# Altium project Control_Quadri.PrjPCB
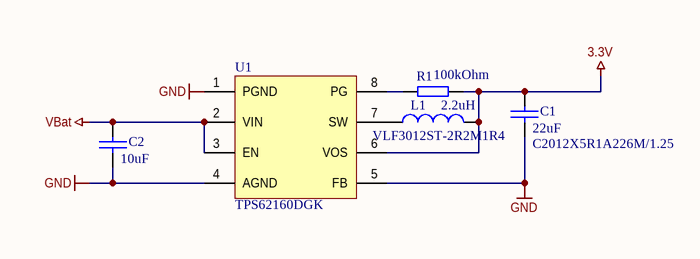
[diagram p0: Alimentation.SchDoc]
4 sheets, 47 parts. Net scope: flat (ports and power ports of the same name join across sheets).
Board file: PCB1.PcbDoc
Sheets:
  Alimentation.SchDoc
  ControlCommande&Motors.SchDoc
  Capteurs.SchDoc
  InterfaceExtension.SchDoc

## Sheet Alimentation.SchDoc
size A3; Organization: Altium Limited; Address1: Laboratoire de Systèmes Embarqués; Address2: 7, rue de la Serre; Address3: 2610 Saint-Imier / Switzerland; PageSetup: Record=PageOptions|CenterHorizontal=True|CenterVertical=True|PrintScale=0.24|XCorrection=1.00|YCorrection=1.00|PrintKind=0|BorderSize=5000000|LeftOffset=0|BottomOffset=0|Orientation=2|PaperLength=1000|PaperWidth=1000|Scale=100|PaperSource=7|PrintQuality=-4|MediaType=1|DitherType=10|PaperKind=A4|PrintScaleMode=1

### Parts
C1  C2012X5R1A226M/1.25  value 22uF  [080501]
C2  value 10uF  [080501]  (hidden comment: GRM21BR61E106KA73L)
L1  VLF3012ST-2R2M1R4  value 2.2uH  [080503]
R1  value 100kOhm  [080501]  (hidden comment: ERJ-6GEYJ104V)
U1  TPS62160DGK  [TSOP65P490-8AM]

### Nets
3.3V: C1.1 L1.2 R1.2 U1.6(VOS)
GND: C1.2 C2.2 U1.1(PGND) U1.4(AGND) U1.5(FB)
VBat: C2.1 U1.2(VIN) U1.3(EN)
NetL1_1: L1.1 U1.7(SW)
NetR1_1: R1.1 U1.8(PG)

### Notes on the sheet
- Title
- Size:
- Date:
- A3
- Author:
- Time:
- Revision:
- Sheet
- of
- File:

### Library data of the parts
C1 C2 = CAPA: EtatCommande: Interne; Text Field1: CAPA; Supplier 1: Digi-Key
  C1: Supplier Part Number 1: 445-7665-1-ND
  C2: Supplier Part Number 1: 490-5523-1-ND
L1 = INDUCTOR: EtatCommande: Commandé; Text Field1: INDUCTOR; Supplier 1: Digi-Key; Supplier Part Number 1: 445-4200-1-ND
R1 = RES: Text Field1: RESISTANCE; EtatCommande: Interne; Supplier 1: Digi-Key; Supplier Part Number 1: P100KACT-ND
U1 = TPS62160: IC BUCK SYNC ADJ 1A 8MSOP; EtatCommande: Commandé; Part Name: TPS62160DGK; Supplier 1: Digi-Key; Supplier Part Number 1: 296-30318-1-ND

## Sheet ControlCommande&Motors.SchDoc
size A3; Organization: Altium Limited; Address1: Laboratoire de Systèmes Embarqués; Address2: 7, rue de la Serre; Address3: 2610 Saint-Imier / Switzerland; PageSetup: Record=PageOptions|CenterHorizontal=True|CenterVertical=True|PrintScale=0.24|XCorrection=1.00|YCorrection=1.00|PrintKind=0|BorderSize=5000000|LeftOffset=0|BottomOffset=0|Orientation=2|PaperLength=1000|PaperWidth=1000|Scale=100|PaperSource=7|PrintQuality=-4|MediaType=1|DitherType=10|PaperKind=A4|PrintScaleMode=1
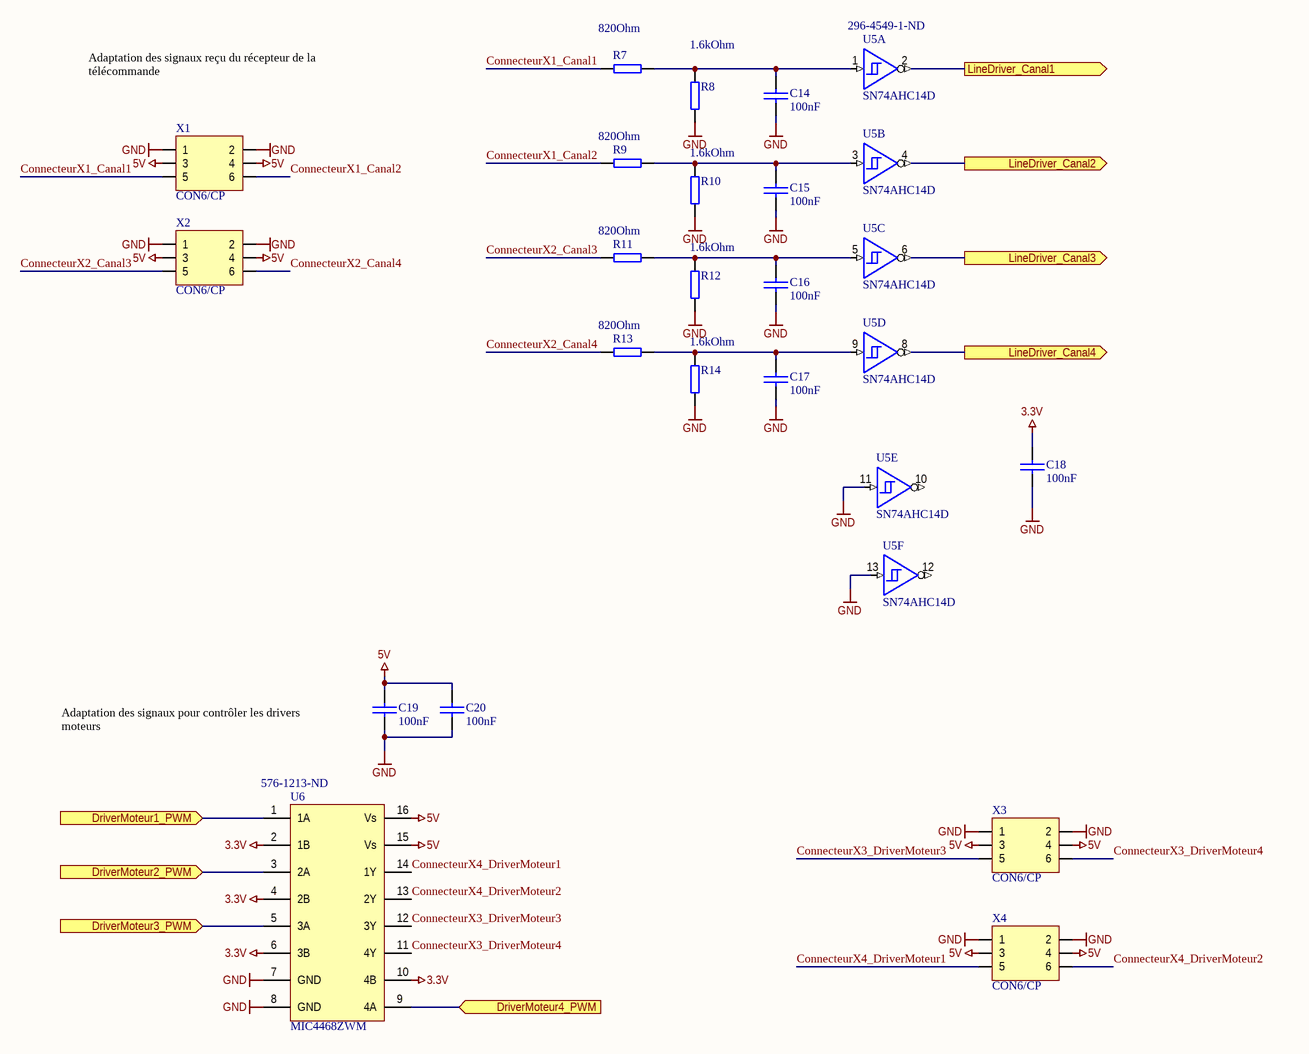
[diagram p1: ControlCommande&Motors.SchDoc]

### Parts
C14  value 100nF  [060301]  (hidden comment: GRM188R71E104KA01D)
C15  value 100nF  [060301]  (hidden comment: GRM188R71E104KA01D)
C16  value 100nF  [060301]  (hidden comment: GRM188R71E104KA01D)
C17  value 100nF  [060301]  (hidden comment: GRM188R71E104KA01D)
C18  value 100nF  [060301]  (hidden comment: GRM188R71E104KA01D)
C19  value 100nF  [060301]  (hidden comment: GRM188R71E104KA01D)
C20  value 100nF  [060301]  (hidden comment: GRM188R71E104KA01D)
R7  value 820Ohm  [080501]  (hidden comment: RMCF0805JT820R)
R8  value 1.6kOhm  [080501]  (hidden comment: ERJ-6GEYJ162V)
R9  value 820Ohm  [080501]  (hidden comment: RMCF0805JT820R)
R10  value 1.6kOhm  [080501]  (hidden comment: ERJ-6GEYJ162V)
R11  value 820Ohm  [080501]  (hidden comment: RMCF0805JT820R)
R12  value 1.6kOhm  [080501]  (hidden comment: ERJ-6GEYJ162V)
R13  value 820Ohm  [080501]  (hidden comment: RMCF0805JT820R)
R14  value 1.6kOhm  [080501]  (hidden comment: ERJ-6GEYJ162V)
U5  SN74AHC14D  Supplier Part Number 1: 296-4549-1-ND  [SO1401]  (parts A,B,C,D,E,F of 6)
U6  MIC4468ZWM  Supplier Part Number 1: 576-1213-ND  [SOIC127P1030-16M]
X1  CON6/CP  [J2X3_2.54]
X2  CON6/CP  [J2X3_2.54]
X3  CON6/CP  [J2X3_2.54]
X4  CON6/CP  [J2X3_2.54]

### Ports
DriverMoteur1_PWM (in), DriverMoteur2_PWM (in), DriverMoteur3_PWM (in), DriverMoteur4_PWM (in), LineDriver_Canal1 (out), LineDriver_Canal2 (out), LineDriver_Canal3 (out), LineDriver_Canal4 (out)

### Nets
3.3V: C18.1 U5.14(3.3V) U6.2(1B) U6.4(2B) U6.6(3B) U6.10(4B)
5V: C19.1 C20.1 U6.15(Vs) U6.16(Vs) X1.3 X1.4 X2.3 X2.4 X3.3 X3.4 X4.3 X4.4
GND: C14.2 C15.2 C16.2 C17.2 C18.2 C19.2 C20.2 R8.2 R10.2 R12.2 R14.2 U5.7(GND) U5.11 U5.13 U6.7(GND) U6.8(GND) X1.1 X1.2 X2.1 X2.2 X3.1 X3.2 X4.1 X4.2
ConnecteurX1_Canal1: R7.1 X1.5
ConnecteurX1_Canal2: R9.1 X1.6
ConnecteurX2_Canal3: R11.1 X2.5
ConnecteurX2_Canal4: R13.1 X2.6
ConnecteurX3_DriverMoteur3: U6.12(3Y) X3.5
ConnecteurX3_DriverMoteur4: U6.11(4Y) X3.6
ConnecteurX4_DriverMoteur1: U6.14(1Y) X4.5
ConnecteurX4_DriverMoteur2: U6.13(2Y) X4.6
NetC14_1: C14.1 R7.2 R8.1 U5.1
NetC15_1: C15.1 R9.2 R10.1 U5.3
NetC16_1: C16.1 R11.2 R12.1 U5.5
NetC17_1: C17.1 R13.2 R14.1 U5.9
NetU5_2: U5.2 ; port LineDriver_Canal1
NetU5_4: U5.4 ; port LineDriver_Canal2
NetU5_6: U5.6 ; port LineDriver_Canal3
NetU5_8: U5.8 ; port LineDriver_Canal4
NetU6_1: U6.1(1A) ; port DriverMoteur1_PWM
NetU6_3: U6.3(2A) ; port DriverMoteur2_PWM
NetU6_5: U6.5(3A) ; port DriverMoteur3_PWM
NetU6_9: U6.9(4A) ; port DriverMoteur4_PWM

Not connected (* = marked no-connect by the designer): U5 10 12

### Notes on the sheet
- (near X1) Adaptation des signaux reçu du récepteur de la télécommande
- Adaptation des signaux pour contrôler les drivers moteurs
- Title
- Size:
- Date:
- A3
- Author:
- Time:
- Revision:
- Sheet
- of
- File:

### Library data of the parts
C14-C20 = CAPA: EtatCommande: Interne; Text Field1: CAPA; Supplier 1: Digi-Key; Supplier Part Number 1: 490-1524-1-ND
R7-R14 = RES: as R1 on sheet Alimentation; Supplier 1: Digi-Key
  R7 R9 R11 R13: Supplier Part Number 1: RMCF0805JT820RDKR-ND
  R8 R10 R12 R14: Supplier Part Number 1: P1.6KACT-ND
U5 = SN74AHC14D: EtatCommande: Commandé; Supplier 1: Digi-Key
U6 = MIC4468: EtatCommande: Commandé; Supplier 1: Digi-Key
X1 = CON6/CP: Connecteur récepteur télécommande cannaux 1 & 2; EtatCommande: Interne
X2 = CON6/CP: Connecteur récepteur télécommande cannaux 3 & 4; EtatCommande: Interne
X3 = CON6/CP: Connecteur contrôleur moteurs 3 (arrière) & 4 (gauche); EtatCommande: Interne
X4 = CON6/CP: Connecteur contrôleur moteurs 1 (avant) & 2 (droite); EtatCommande: Interne

## Sheet Capteurs.SchDoc
size A3; Organization: Altium Limited; Address1: Laboratoire de Systèmes Embarqués; Address2: 7, rue de la Serre; Address3: 2610 Saint-Imier / Switzerland; PageSetup: Record=PageOptions|CenterHorizontal=True|CenterVertical=True|PrintScale=0.24|XCorrection=1.00|YCorrection=1.00|PrintKind=0|BorderSize=5000000|LeftOffset=0|BottomOffset=0|Orientation=2|PaperLength=1000|PaperWidth=1000|Scale=100|PaperSource=7|PrintQuality=-4|MediaType=1|DitherType=10|PaperKind=A4|PrintScaleMode=1
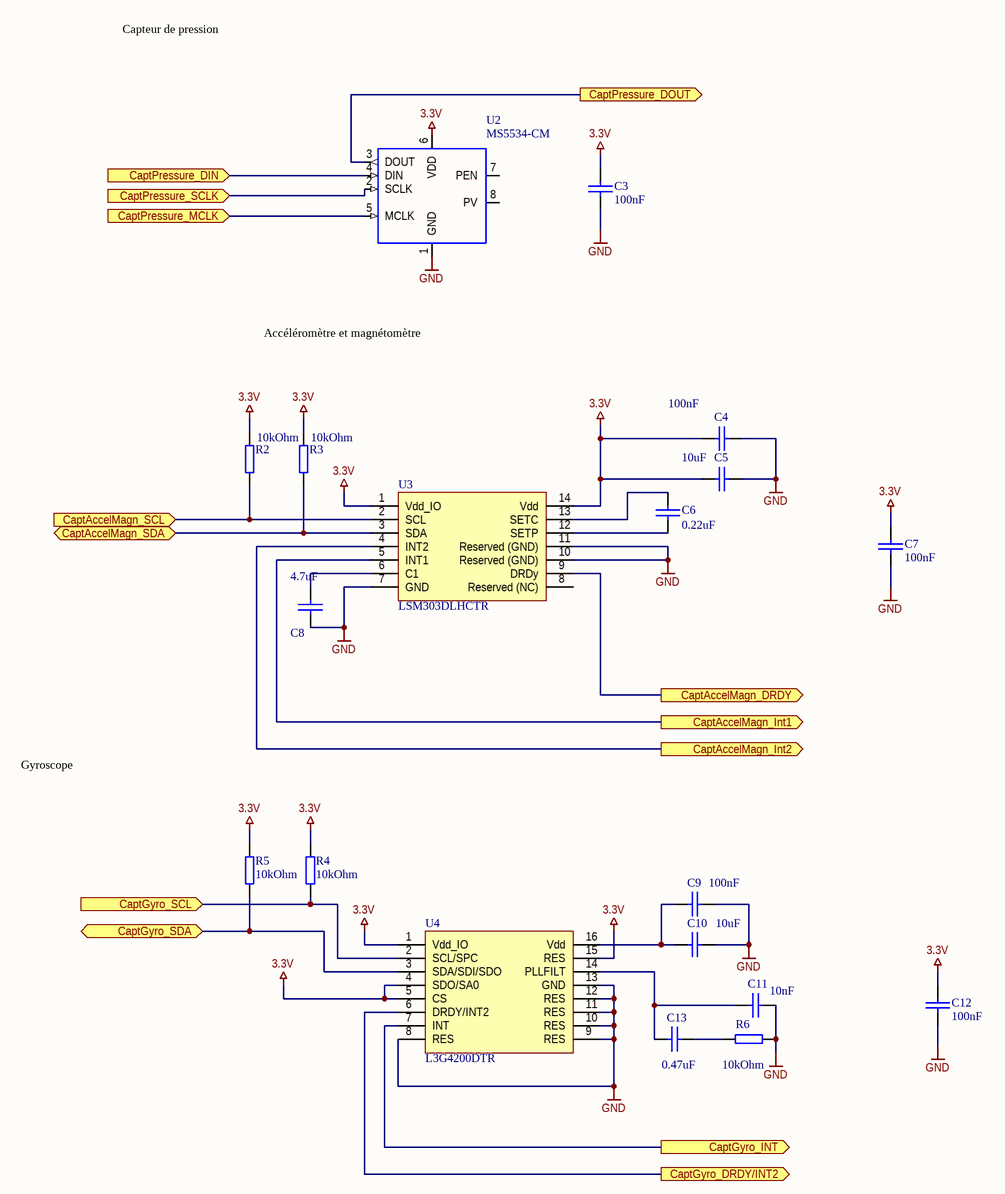
[diagram p2: Capteurs.SchDoc]

### Parts
C3  value 100nF  [060301]  (hidden comment: GRM188R71E104KA01D)
C4  value 100nF  [060301]  (hidden comment: GRM188R71E104KA01D)
C5  value 10uF  [080501]  (hidden comment: 08056D106KAT2A)
C6  value 0.22uF  [120601]  (hidden comment: UMK212F224ZD-T)
C7  value 100nF  [060301]  (hidden comment: GRM188R71E104KA01D)
C8  value 4.7uF  [080501]  (hidden comment: C0805C475K4PACTU)
C9  value 100nF  [060301]  (hidden comment: GRM188R71E104KA01D)
C10  value 10uF  [080501]  (hidden comment: 08056D106KAT2A)
C11  value 10nF  [080501]  (hidden comment: C0805C103K4RACTU)
C12  value 100nF  [060301]  (hidden comment: GRM188R71E104KA01D)
C13  value 0.47uF  [060301]  (hidden comment: C2012Y5V1H474Z/0.85)
R2  value 10kOhm  [080501]  (hidden comment: ERJ-6GEYJ103V)
R3  value 10kOhm  [080501]  (hidden comment: ERJ-6GEYJ103V)
R4  value 10kOhm  [080501]  (hidden comment: ERJ-6GEYJ103V)
R5  value 10kOhm  [080501]  (hidden comment: ERJ-6GEYJ103V)
R6  value 10kOhm  [080501]  (hidden comment: ERJ-6GEYJ103V)
U2  MS5534-CM  [MS5534B]
U3  LSM303DLHCTR  [LGA-14L]
U4  L3G4200DTR  [LGA-16]

### Ports
CaptAccelMagn_DRDY (out), CaptAccelMagn_Int1 (out), CaptAccelMagn_Int2 (out), CaptAccelMagn_SCL (in), CaptAccelMagn_SDA (bidir), CaptGyro_DRDY/INT2 (out), CaptGyro_INT (out), CaptGyro_SCL (in), CaptGyro_SDA (bidir), CaptPressure_DIN (in), CaptPressure_DOUT (out), CaptPressure_MCLK (in), CaptPressure_SCLK (in)

### Nets
3.3V: C3.1 C4.2 C5.2 C7.1 C12.1 R2.2 R3.2 R4.2 R5.2 U2.6(VDD) U3.1(Vdd_IO) U3.14(Vdd) U4.1(Vdd_IO) U4.4(SDO/SA0) U4.5(CS) U4.15(RES)
GND: C3.2 C4.1 C5.1 C7.2 C8.2 C9.1 C10.1 C11.1 C12.2 R6.2 U2.1(GND) U3.7(GND) U3.10(Reserved_(GND)) U3.11(Reserved_(GND)) U4.8(RES) U4.9(RES) U4.10(RES) U4.11(RES) U4.12(RES) U4.13(GND)
NetC6_1: C6.1 U3.12(SETP)
NetC6_2: C6.2 U3.13(SETC)
NetC8_1: C8.1 U3.6(C1)
NetC9_2: C9.2 C10.2 U4.16(Vdd)
NetC11_2: C11.2 C13.2 U4.14(PLLFILT)
NetC13_1: C13.1 R6.1
NetR2_1: R2.1 U3.2(SCL) ; port CaptAccelMagn_SCL
NetR3_1: R3.1 U3.3(SDA) ; port CaptAccelMagn_SDA
NetR4_1: R4.1 U4.2(SCL/SPC) ; port CaptGyro_SCL
NetR5_1: R5.1 U4.3(SDA/SDI/SDO) ; port CaptGyro_SDA
NetU2_2: U2.2(SCLK) ; port CaptPressure_SCLK
NetU2_3: U2.3(DOUT) ; port CaptPressure_DOUT
NetU2_4: U2.4(DIN) ; port CaptPressure_DIN
NetU2_5: U2.5(MCLK) ; port CaptPressure_MCLK
NetU3_4: U3.4(INT2) ; port CaptAccelMagn_Int2
NetU3_5: U3.5(INT1) ; port CaptAccelMagn_Int1
NetU3_9: U3.9(DRDy) ; port CaptAccelMagn_DRDY
NetU4_6: U4.6(DRDY/INT2) ; port CaptGyro_DRDY/INT2
NetU4_7: U4.7(INT) ; port CaptGyro_INT

Not connected (* = marked no-connect by the designer): U2 7(PEN) 8(PV); U3 8(Reserved_(NC))

### Notes on the sheet
- Capteur de pression
- Accéléromètre et magnétomètre
- Gyroscope
- Title
- Size:
- Date:
- A3
- Author:
- Time:
- Revision:
- Sheet
- of
- File:

### Library data of the parts
C3-C5 C7-C13 = CAPA: EtatCommande: Interne; Text Field1: CAPA; Supplier 1: Digi-Key
  C3 C4 C7 C9 C12: Supplier Part Number 1: 490-1524-1-ND
  C5 C10: Supplier Part Number 1: 478-1417-1-ND
  C8: Supplier Part Number 1: C0805C475K4PACTU-ND
  C11: Supplier Part Number 1: C0805C103K4RACTU-ND
  C13: Supplier Part Number 1: 587-1250-1-ND
C6 = CAPA: EtatCommande: Commandé; Text Field1: CAPA; Supplier 1: Digi-Key; Supplier Part Number 1: 587-1306-1-ND
R2-R6 = RES: as R1 on sheet Alimentation; Supplier 1: Digi-Key
  R2 R3 R5 R6: Supplier Part Number 1: P10KACT-ND
  R4: Supplier Part Number 1: P10KADKR-ND
U2 = MS5534B: Barometer Module; EtatCommande: Commandé; Supplier 1: Digi-Key; Supplier Part Number 1: 223-1100-1-ND
U3 = LSM303DLHC: Accéléromètre et magnétomètre; EtatCommande: Commandé; Supplier 1: Digi-Key; Supplier Part Number 1: 497-11918-1-ND
U4 = L3G4200D: Gyroscope; EtatCommande: Commandé; Part Name: L3G4200D; Supplier 1: Digi-Key; Supplier Part Number 1: 497-11071-1-ND

## Sheet InterfaceExtension.SchDoc
size A3; Organization: Altium Limited; Address1: Laboratoire de Systèmes Embarqués; Address2: 7, rue de la Serre; Address3: 2610 Saint-Imier / Switzerland; PageSetup: Record=PageOptions|CenterHorizontal=True|CenterVertical=True|PrintScale=0.24|XCorrection=1.00|YCorrection=1.00|PrintKind=0|BorderSize=5000000|LeftOffset=0|BottomOffset=0|Orientation=2|PaperLength=1000|PaperWidth=1000|Scale=100|PaperSource=7|PrintQuality=-4|MediaType=1|DitherType=10|PaperKind=A4|PrintScaleMode=1
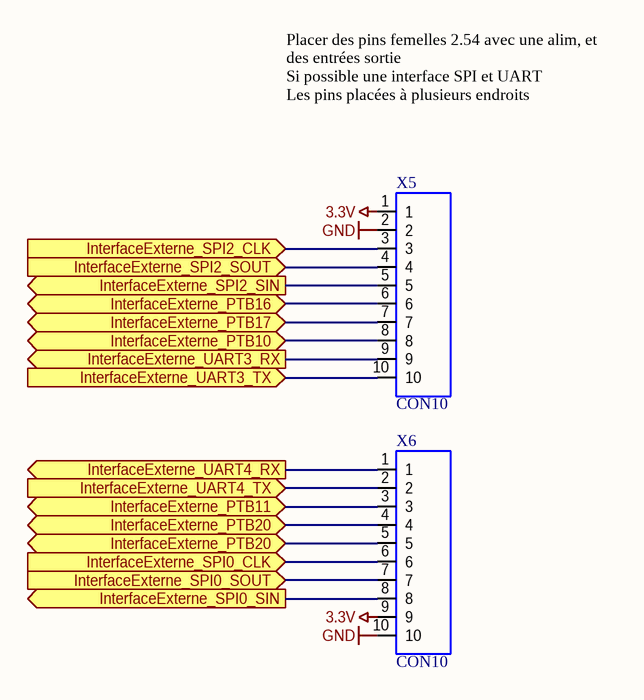
[diagram p3: InterfaceExtension.SchDoc]

### Parts
X5  CON10  [SIP10]
X6  CON10  [SIP10]

### Ports
InterfaceExterne_PTB10 (bidir), InterfaceExterne_PTB11 (bidir), InterfaceExterne_PTB16 (bidir), InterfaceExterne_PTB17 (bidir), InterfaceExterne_PTB20 (bidir), InterfaceExterne_SPI0_CLK (in), InterfaceExterne_SPI0_SIN (out), InterfaceExterne_SPI0_SOUT (in), InterfaceExterne_SPI2_CLK (in), InterfaceExterne_SPI2_SIN (out), InterfaceExterne_SPI2_SOUT (in), InterfaceExterne_UART3_RX (out), InterfaceExterne_UART3_TX (in), InterfaceExterne_UART4_RX (out), InterfaceExterne_UART4_TX (in)

### Nets
3.3V: X5.1 X6.9
GND: X5.2 X6.10
NetX5_3: X5.3 ; port InterfaceExterne_SPI2_CLK
NetX5_4: X5.4 ; port InterfaceExterne_SPI2_SOUT
NetX5_5: X5.5 ; port InterfaceExterne_SPI2_SIN
NetX5_6: X5.6 ; port InterfaceExterne_PTB16
NetX5_7: X5.7 ; port InterfaceExterne_PTB17
NetX5_8: X5.8 ; port InterfaceExterne_PTB10
NetX5_9: X5.9 ; port InterfaceExterne_UART3_RX
NetX5_10: X5.10 ; port InterfaceExterne_UART3_TX
NetX6_1: X6.1 ; port InterfaceExterne_UART4_RX
NetX6_2: X6.2 ; port InterfaceExterne_UART4_TX
NetX6_3: X6.3 ; port InterfaceExterne_PTB11
NetX6_4: X6.4 X6.5 ; port InterfaceExterne_PTB20
NetX6_6: X6.6 ; port InterfaceExterne_SPI0_CLK
NetX6_7: X6.7 ; port InterfaceExterne_SPI0_SOUT
NetX6_8: X6.8 ; port InterfaceExterne_SPI0_SIN

### Notes on the sheet
- Placer des pins femelles 2.54 avec une alim, et des entrées sortie
  Si possible une interface SPI et UART
  Les pins placées à plusieurs endroits
- Title
- Size:
- Date:
- A3
- Author:
- Time:
- Revision:
- Sheet
- of
- File:

### Library data of the parts
X5 X6 = CON10: Right: 30; Bottom: 110; EtatCommande: Interne

## Nets that join several sheets
3.3V: Alimentation (C1.1 L1.2 R1.2 U1.6), ControlCommande&Motors (6 pins), Capteurs (16 pins), InterfaceExtension (X5.1 X6.9)
GND: Alimentation (5 pins), ControlCommande&Motors (24 pins), Capteurs (20 pins), InterfaceExtension (X5.2 X6.10)